# Altium schematic sheet tanh function cell.SchDoc
size Letter; SheetNumber: 14; SheetTotal: 14
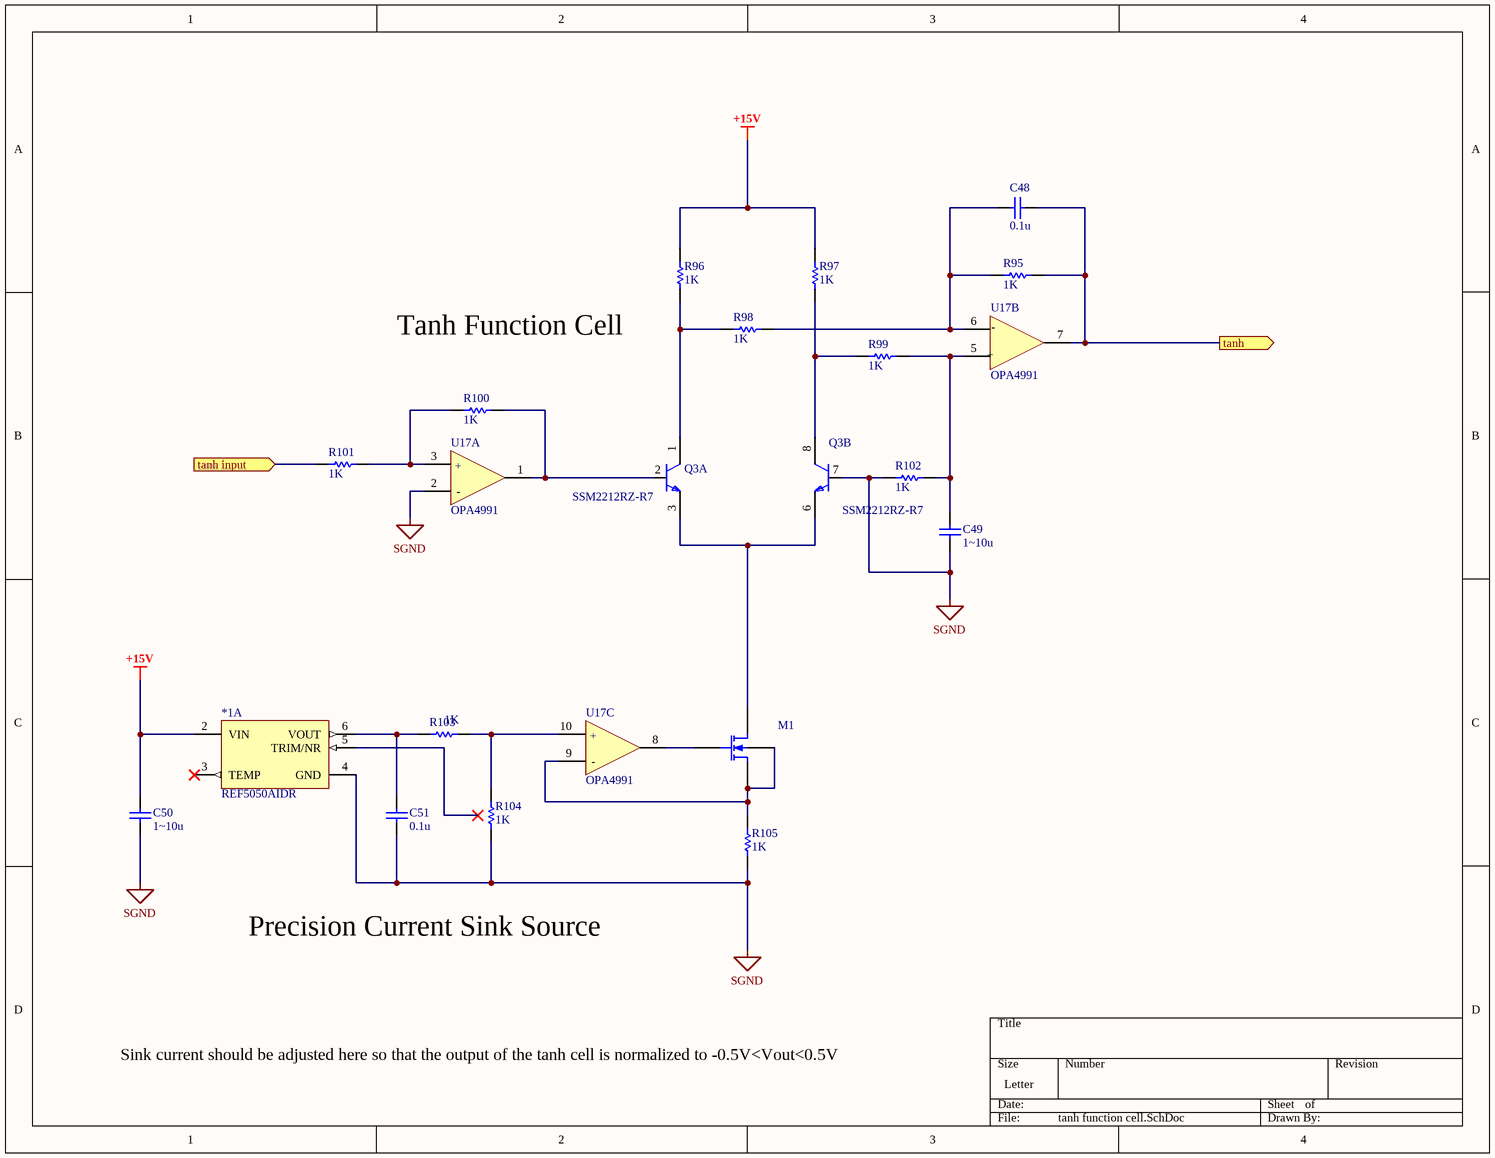
[diagram p0: tanh function cell.SchDoc]

## Parts
*1  REF5050AIDR  [D0008A_M]  (part A of 2)
C48  value 0.1u  (hidden comment: Capacitor)
C49  value 1~10u  (hidden comment: Capacitor)
C50  value 1~10u  (hidden comment: Capacitor)
C51  value 0.1u  (hidden comment: Capacitor)
M1  N-channel MOSFET BSIM4v7 v4.7.0 Model  (value not drawn)
Q3  SSM2212RZ-R7  [FP-R-8-IPC_B]  (parts A,B of 3)
R95  value 1K  (hidden comment: Resistor)
R96  value 1K  (hidden comment: Resistor)
R97  value 1K  (hidden comment: Resistor)
R98  value 1K  (hidden comment: Resistor)
R99  value 1K  (hidden comment: Resistor)
R100  value 1K  (hidden comment: Resistor)
R101  value 1K  (hidden comment: Resistor)
R102  value 1K  (hidden comment: Resistor)
R103  value 1K  (hidden comment: Resistor)
R104  value 1K  (hidden comment: Resistor)
R105  value 1K  (hidden comment: Resistor)
U17  OPA4991  [FP-D0014A-IPC_B]  (parts A,B,C of 5)

## Ports
tanh (out), tanh input (in)

## Nets
+15V: *1.2(VIN) C50.2 R96.2 R97.2
SGND: *1.4(GND) C49.1 C50.1 C51.1 Q3.7(B2) R102.1 R104.2 R105.1 U17.2(IN1-)
tanh: C48.1 R95.1 U17.7(OUT2) ; port tanh
tanh input: R101.2 ; port tanh input
Net*1_6: *1.6(VOUT) C51.2 R103.2
NetC48_2: C48.2 R95.2 R98.1 U17.6(IN2-)
NetC49_2: C49.2 R99.1 R102.2 U17.5(IN2+)
NetM1_1: M1.1(D) Q3.3(E1) Q3.6(E2)
NetM1_2: M1.2(G) U17.8(OUT3)
NetM1_3: M1.3(S) M1.4(B) R105.2 U17.9(IN3-)
NetQ3_1: Q3.1(C1) R96.1 R98.2
NetQ3_2: Q3.2(B1) R100.1 U17.1(OUT1)
NetQ3_8: Q3.8(C2) R97.1 R99.2
NetR100_2: R100.2 R101.1 U17.3(IN1+)
NetR103_1: R103.1 R104.1 U17.10(IN3+)

Not connected (* = marked no-connect by the designer): *1 3(TEMP)* 5(TRIM/NR)*

## Notes on the sheet
- (near R96) Tanh Function Cell
- Precision Current Sink Source
- Sink current should be adjusted here so that the output of the tanh cell is normalized to -0.5V<Vout<0.5V
- (in symbol OPA4991IDR, part A) +; -
- (in symbol OPA4991IDR, part B) -; +
- (in symbol OPA4991IDR, part C) +; -

## Library data of the parts
*1 = REF5050AIDR: Three Terminal Voltage Reference, 1 Output, 5V, Trim/Adjustable, PDSO8; Manufacturer: Texas Instruments; Package Body Material: Plastic; Channels: 1; Package Equivalence Code: SOP8,.25; Max Supply Voltage: 18V; Min Supply Voltage: 2.7V; Temp Coef of Voltage-Max: 3ppm/°C; Trim/Adjustable Output: Yes; Voltage Tolerance-Max: 0.1%; Max Output Voltage: 5.005V; Min Output Voltage: 4.995V; Qualification Status: Not Qualified; Supplier: Mouser; Supplier Part Number: 595-REF5050AIDR; Manufacturer Part Number: REF5050AIDR; RoHS: Yes; Category: Voltage References; Stock: 15005; Pricing: 1=3.52, 10=3.17, 50=3.17, 100=2.59, 250=2.46, 500=2.21, 1000=1.86, 2500=1.77, 5000=1.7, 10000=1.77 (USD); Case/Package: SOP; Pins: 8; Package Shape: Rectangular; Terminal Finish: Nickel; Min Operating Temperature: -40°C; Max Operating Temperature: 125°C; JESD-609 Code: e4; Throw Configuration: THREE TERMINAL VOLTAGE REFERENCE; JESD-30 Code: R-PDSO-G8; Moisture Sensitivity Level: 2; Number of Outputs: 1; Nominal Output Voltage: 5V; Package Style: SMALL OUTLINEMeter; Peak Reflow Temperature (Cel): 260°C; Surface Mount: Yes; Terminal Form: Gull Wing; Terminal Position: DUAL; Length: 4.9mm; Width: 3.9mm; Height - Seated (Max): 1.75mm; Terminal Pitch: 1.27mm; Temperature Grade: AUTOMOTIVE; Reach SVHC Compliant: Yes; RoHS Compliant: Yes; ComponentLink1URL: https://www.ti.com:443/lit/ds/symlink/ref5010.pdf?src-supplier=IHS+Markit; ComponentLink1Description: https://www.ti.com:443/lit/ds/symlink/ref5010.pdf?src-supplier=IHS+Markit; ComponentLink2URL: https://datasheet.ciiva.com/3236/ref5050-3236312.pdf?src-supplier=Avnet; ComponentLink2Description: https://datasheet.ciiva.com/3236/ref5050-3236312.pdf?src-supplier=Avnet; ComponentLink3URL: https://datasheet.ciiva.com/2012/ref5020-2012761.pdf?src-supplier=Digikey; ComponentLink3Description: https://datasheet.ciiva.com/2012/ref5020-2012761.pdf?src-supplier=Digikey
C48-C51 = Capacitor: SimulationGenericComponent: True
M1 = MOSFET N-ch Lev14_3: A0: 1; A1: 0; AIGBACC: 0.0136; AIGBINV: 0.0111; AT: 33000; BG0SUB: 1.16; BGIDL: 2.3e09; BIGBACC: 0.00171; BIGBINV: 0.000949; BVD: 10; CAPMOD: 2; CDSC: 0.00024; CF: 1.07725e-10; CGDO: 1.03594e-09; CGIDL: 0.5; CIGBACC: 0.075; CIGBINV: 0.006; CJD: 0.0005; CJSWD: 5e-10; CKAPPAD: 0.6; CLC: 1e-07; DELTA: 0.01; DROUT: 0.56; DVT0: 2.2; DVT1: 0.53; DVT1W: 5.3e06; DVT2: -0.032; EASUB: 4.05; EGIDL: 0.8; EIGBINV: 1.1; EM: 4.1e07; EOT: 1.5e-09; EPSRGATE: 11.7; EPSROX: 3.9; ETA0: 0.08; ETAB: -0.07; EU: 1.67; GBMIN: 1e-12; IJTHDFWD: 0.1; JSD: 0.0001; K3: 80; KETA: -0.047; KT1: -0.11; KT2: 0.022; LC: 5e-09; LETAB: -0; LP: 1e-08; LPE0: 1.74e-07; MJSWD: 0.33; MOIN: 15; NDEP: 1.7e17; NI0SUB: 1.45e10; NIGBINV: 3; NJTS: 20; NOIA: 6.25e41; NOIB: 3.125e26; NOIC: 8.75e09; NSD: 1e20; NSUB: 6e16; PCLM: 1.3; PDIBLC1: 0.39; PDIBLC2: 0.0086; PSCBE1: 4.24e08; PSCBE2: 1e-05; RBDBX0: 100; RBPD0: 50; RDSW: 200; RNOIA: 0.577; RNOIB: 0.5164; RNOIC: 0.395; SAREF: 1e-06; TBGASUB: 0.000702; TBGBSUB: 1108; TEMPEOT: 300.15; TNOIA: 1.5; TNOIB: 3.5; TOXE: 3e-09; U0: 0.067; UA: 1e-09; UB: 1e-19; UB1: -1e-18; UC: -4.65e-11; UC1: -5.6e-11; UCSTE: -0.004775; UTE: -1.5; VBD_MAX: 1e99; VBM: -3; VFB: -1; VOFF: -0.08; VSAT: 80000; VTH0: 0.7; VTL: 200000; W0: 2.5e-06; XJ: 1.5e-07; XRCRG1: 12; XT: 1.55e-07; XTSD: 0.02; SimulationGenericComponent: True; A2: 1; ACDE: 1; ADOS: 1; AF: 1; AGIDL: 0; AGISL: 0; AGS: 0; AIGC: 0.0136; AIGD: 0.0136; AIGS: 0.0136; AIGSD: 0.0136; ALPHA0: 0; ALPHA1: 0; B0: 0; B1: 0; BDOS: 1; BETA0: 0; BGISL: 2.3e09; BIGC: 0.00171; BIGD: 0.00171; BIGS: 0.00171; BIGSD: 0.00171; BINUNIT: 1; BVS: 10; CDSCB: 0; CDSCD: 0; CGBO: 0; CGDL: 0; CGISL: 0.5; CGSL: 0; CGSO: 1.03594e-09; CIGC: 0.075; CIGD: 0.075; CIGS: 0.075; CIGSD: 0.075; CIT: 0; CJS: 0.0005; CJSWGD: 5e-10; CJSWGS: 5e-10; CJSWS: 5e-10; CKAPPAS: 0.6; CLE: 0.6; CVCHARGEMOD: 0; DIOMOD: 1; DLC: 0; DLCIG: 0; DLCIGD: 0; DMCG: 0; DMCGT: 0; DMCI: 0; DMDG: 0; DSUB: 0.56; DTOX: 0; DVT0W: 0; DVT2W: -0.032; DVTP0: 0; DVTP1: 0; DVTP2: 0; DVTP3: 0; DVTP4: 0; DVTP5: 0; DWB: 0; DWC: 0; DWG: 0; DWJ: 0; EF: 1; EGISL: 0.8; EPSRSUB: 11.7; FGIDL: 1; FGISL: 1; FNOIMOD: 1; FPROUT: 0; GAMMA1: 0; GAMMA2: 0; GIDLMOD: 0; IGBMOD: 0; IGCMOD: 0; IJTHDREV: 0.1; IJTHSFWD: 0.1; IJTHSREV: 0.1; JSS: 0.0001; JSWD: 0; JSWGD: 0; JSWGS: 0; JSWS: 0; JTSD: 0; JTSS: 0; JTSSWD: 0; JTSSWGD: 0; JTSSWGS: 0; JTSSWS: 0; JTWEFF: 0; K1: 0; K2: 0; K2WE: 0; K3B: 0; KF: 0; KGIDL: 0; KGISL: 0; KT1L: 0; KU0: 0; KU0WE: 0; KVSAT: 0; KVTH0: 0; KVTH0WE: 0; LA0: 0; LA1: 0; LA2: 0; LACDE: 0; LAGIDL: 0; LAGISL: 0; LAGS: 0; LAIGBACC: 0; LAIGBINV: 0; LAIGC: 0; LAIGD: 0; LAIGS: 0; LAIGSD: 0; LALPHA0: 0; LALPHA1: 0; LAMBDA: 0; LAT: 0; LB0: 0; LB1: 0; LBETA0: 0; LBGIDL: 0; LBGISL: 0; LBIGBACC: 0; LBIGBINV: 0; LBIGC: 0; LBIGD: 0; LBIGS: 0; LBIGSD: 0; LCDSC: 0; LCDSCB: 0; LCDSCD: 0; LCF: 0; LCGDL: 0; LCGIDL: 0; LCGISL: 0; LCGSL: 0; LCIGBACC: 0; LCIGBINV: 0; LCIGC: 0; LCIGD: 0; LCIGS: 0; LCIGSD: 0; LCIT: 0; LCKAPPAD: 0; LCKAPPAS: 0; LCLC: 0; LCLE: 0; LDELTA: 0; LDROUT: 0; LDSUB: 0; LDVT0: 0; LDVT0W: 0; LDVT1: 0; LDVT1W: 0; LDVT2: 0; LDVT2W: 0; LDVTP0: 0; LDVTP1: 0; LDVTP2: 0; LDVTP3: 0; LDVTP4: 0; LDVTP5: 0; LDWB: 0; LDWG: 0; LEFFEOT: 1; LEGIDL: 0; LEGISL: 0; LEIGBINV: 0; LETA0: 0; LEU: 0; LFGIDL: 0; LFGISL: 0; LFPROUT: 0; LGAMMA1: 0; LGAMMA2: 0; LINT: 0; LINTNOI: 0; LK1: 0; LK2: 0; LK2WE: 0; LK3: 0; LK3B: 0; LKETA: 0; LKGIDL: 0; LKGISL: 0; LKT1: 0; LKT1L: 0; LKT2: 0; LKU0: 0; LKU0WE: 0; LKVTH0: 0; LKVTH0WE: 0; LL: 0; LLAMBDA: 0; LLC: 0; LLN: 1; LLODKU0: 0; LLODVTH: 0; LLP: 0; LLPE0: 0; LLPEB: 0; LMAX: 1; LMIN: 0; LMINV: 0; LMINVCV: 0; LMOIN: 0; LNDEP: 0; LNFACTOR: 0; LNGATE: 0; LNIGBACC: 0; LNIGBINV: 0; LNIGC: 0; LNOFF: 0; LNSD: 0; LNSUB: 0; LNTOX: 0; LODETA0: 1; LODK2: 1; LPCLM: 0; LPDIBLC1: 0; LPDIBLC2: 0; LPDIBLCB: 0; LPDITS: 0; LPDITSD: 0; LPEB: 0; LPHIN: 0; LPIGCD: 0; LPOXEDGE: 0; LPRT: 0; LPRWB: 0; LPRWG: 0; LPSCBE1: 0; LPSCBE2: 0; LPVAG: 0; LRDSW: 0; LRDW: 0; LRGIDL: 0; LRGISL: 0; LRSW: 0; LTETA0: 0; LTNFACTOR: 0; LTVFBSDOFF: 0; LTVOFF: 0; LTVOFFCV: 0; LU0: 0; LUA: 0; LUA1: 0; LUB: 0; LUB1: 0; LUC: 0; LUC1: 0; LUCS: 0; LUCSTE: 0; LUD: 0; LUD1: 0; LUP: 0; LUTE: 0; LVBM: 0; LVBX: 0; LVFB: 0; LVFBCV: 0; LVFBSDOFF: 0; LVOFF: 0; LVOFFCV: 0; LVSAT: 0; LVTH0: 0; LVTL: 0; LW: 0; LW0: 0; LWC: 0; LWL: 0; LWLC: 0; LWN: 1; LWR: 0; LXJ: 0; LXN: 0; LXRCRG1: 0; LXRCRG2: 0; LXT: 0; MINV: 0; MINVCV: 0; MJD: 0.5; MJS: 0.5; MJSWGD: 0.33; MJSWGS: 0.33; MJSWS: 0.33; MOBMOD: 0; MTRLCOMPATMOD: 0; MTRLMOD: 0; NFACTOR: 1; NGATE: 0; NIGBACC: 1; NIGC: 1; NJD: 1; NJS: 1; NJTSD: 20; NJTSSW: 20; NJTSSWD: 20; NJTSSWG: 20; NJTSSWGD: 20; NOFF: 1; NTNOI: 1; NTOX: 1; PA0: 0; PA1: 0; PA2: 0; PACDE: 0; PAGIDL: 0; PAGISL: 0; PAGS: 0; PAIGBACC: 0; PAIGBINV: 0; PAIGC: 0; PAIGD: 0; PAIGS: 0; PAIGSD: 0; PALPHA0: 0; PALPHA1: 0; PARAMCHK: 1; PAT: 0; PB0: 0; PB1: 0; PBD: 1; PBETA0: 0; PBGIDL: 0; PBGISL: 0; PBIGBACC: 0; PBIGBINV: 0; PBIGC: 0; PBIGD: 0; PBIGS: 0; PBIGSD: 0; PBS: 1; PBSWD: 1; PBSWGD: 1; PBSWGS: 1; PBSWS: 1; PCDSC: 0; PCDSCB: 0; PCDSCD: 0; PCF: 0; PCGDL: 0; PCGIDL: 0; PCGISL: 0; PCGSL: 0; PCIGBACC: 0; PCIGBINV: 0; PCIGC: 0; PCIGD: 0; PCIGS: 0; PCIGSD: 0; PCIT: 0; PCKAPPAD: 0; PCKAPPAS: 0; PCLC: 0; PCLE: 0; PDELTA: 0; PDIBLCB: 0; PDITS: 0; PDITSD: 0; PDITSL: 0; PDROUT: 0; PDSUB: 0; PDVT0: 0; PDVT0W: 0; PDVT1: 0; PDVT1W: 0; PDVT2: 0; PDVT2W: 0; PDVTP0: 0; PDVTP1: 0; PDVTP2: 0; PDVTP3: 0; PDVTP4: 0; PDVTP5: 0; PDWB: 0; PDWG: 0; PEGIDL: 0; PEGISL: 0; PEIGBINV: 0; PERMOD: 1; PETA0: 0; PETAB: 0; PEU: 0; PFGIDL: 0; PFGISL: 0; PFPROUT: 0; PGAMMA1: 0; PGAMMA2: 0; PHIG: 4.05; PHIN: 0; PIGCD: 1; PK1: 0; PK2: 0; PK2WE: 0; PK3: 0; PK3B: 0; PKETA: 0; PKGIDL: 0; PKGISL: 0; PKT1: 0; PKT1L: 0; PKT2: 0; PKU0: 0; PKU0WE: 0; PKVTH0: 0; PKVTH0WE: 0; PLAMBDA: 0; PLP: 0; PLPE0: 0; PLPEB: 0; PMINV: 0; PMINVCV: 0; PMOIN: 0; PNDEP: 0; PNFACTOR: 0; PNGATE: 0; PNIGBACC: 0; PNIGBINV: 0; PNIGC: 0; PNOFF: 0; PNSD: 0; PNSUB: 0; PNTOX: 0; POXEDGE: 1; PPCLM: 0; PPDIBLC1: 0; PPDIBLC2: 0; PPDIBLCB: 0; PPDITS: 0; PPDITSD: 0; PPHIN: 0; PPIGCD: 0; PPOXEDGE: 0; PPRT: 0; PPRWB: 0; PPRWG: 0; PPSCBE1: 0; PPSCBE2: 0; PPVAG: 0; PRDSW: 0; PRDW: 0; PRGIDL: 0; PRGISL: 0; PRSW: 0; PRT: 0; PRWB: 0; PRWG: 1; PTETA0: 0; PTNFACTOR: 0; PTVFBSDOFF: 0; PTVOFF: 0; PTVOFFCV: 0; PU0: 0; PUA: 0; PUA1: 0; PUB: 0; PUB1: 0; PUC: 0; PUC1: 0; PUCS: 0; PUCSTE: 0; PUD: 0; PUD1: 0; PUP: 0; PUTE: 0; PVAG: 0; PVBM: 0; PVBX: 0; PVFB: 0; PVFBCV: 0; PVFBSDOFF: 0; PVOFF: 0; PVOFFCV: 0; PVSAT: 0; PVTH0: 0; PVTL: 0; PW0: 0; PWR: 0; PXJ: 0; PXN: 0; PXRCRG1: 0; PXRCRG2: 0; PXT: 0; RBDBY0: 100; RBPBX0: 100; RBPBXL: 0; RBPBXNF: 0; RBPBXW: 0; RBPBY0: 100; RBPBYL: 0; RBPBYNF: 0; RBPBYW: 0; RBPDL: 0; RBPDNF: 0; RBPDW: 0; RBPS0: 50; RBPSL: 0; RBPSNF: 0; RBPSW: 0; RBSBX0: 100; RBSBY0: 100; RBSDBXL: 0; RBSDBXNF: 0; RBSDBXW: 0; RBSDBYL: 0; RBSDBYNF: 0; RBSDBYW: 0; RDSMOD: 0; RDSWMIN: 0; RDW: 100; RDWMIN: 0; RGIDL: 1; RGISL: 1; RSH: 0; RSHG: 0.1; RSW: 100; RSWMIN: 0; SBREF: 1e-06; SCREF: 1e-06; STETA0: 0; STK2: 0; TCJ: 0; TCJSW: 0; TCJSWG: 0; TEMPMOD: 0; TETA0: 0; TKU0: 0; TNFACTOR: 0; TNJTS: 0; TNJTSD: 0; TNJTSSW: 0; TNJTSSWD: 0; TNJTSSWG: 0; TNJTSSWGD: 0; TNOIC: 0; TNOIMOD: 0; TNOM: 300.15; TOXM: 3e-09; TOXP: 3e-09; TOXREF: 3e-09; TPB: 0; TPBSW: 0; TPBSWG: 0; TVFBSDOFF: 0; TVOFF: 0; TVOFFCV: 0; UA1: 1e-09; UCS: 1.67; UD: 0; UD1: 0; UP: 0; VBDR_MAX: 1e99; VBS_MAX: 1e99; VBSR_MAX: 1e99; VBX: 0; VDDEOT: 1.5; VDS_MAX: 1e99; VERSION: 4.8.1; VFBCV: -1; VFBSDOFF: 0; VGB_MAX: 1e99; VGBR_MAX: 1e99; VGD_MAX: 1e99; VGDR_MAX: 1e99; VGS_MAX: 1e99; VGSR_MAX: 1e99; VOFFCV: 0; VOFFCVL: 0; VOFFL: 0; VTSD: 10; VTSS: 10; VTSSWD: 10; VTSSWGD: 10; VTSSWGS: 10; VTSSWS: 10; WA0: 0; WA1: 0; WA2: 0; WACDE: 0; WAGIDL: 0; WAGISL: 0; WAGS: 0; WAIGBACC: 0; WAIGBINV: 0; WAIGC: 0; WAIGD: 0; WAIGS: 0; WAIGSD: 0; WALPHA0: 0; WALPHA1: 0; WAT: 0; WB0: 0; WB1: 0; WBETA0: 0; WBGIDL: 0; WBGISL: 0; WBIGBACC: 0; WBIGBINV: 0; WBIGC: 0; WBIGD: 0; WBIGS: 0; WBIGSD: 0; WCDSC: 0; WCDSCB: 0; WCDSCD: 0; WCF: 0; WCGDL: 0; WCGIDL: 0; WCGISL: 0; WCGSL: 0; WCIGBACC: 0; WCIGBINV: 0; WCIGC: 0; WCIGD: 0; WCIGS: 0; WCIGSD: 0; WCIT: 0; WCKAPPAD: 0; WCKAPPAS: 0; WCLC: 0; WCLE: 0; WDELTA: 0; WDROUT: 0; WDSUB: 0; WDVT0: 0; WDVT0W: 0; WDVT1: 0; WDVT1W: 0; WDVT2: 0; WDVT2W: 0; WDVTP0: 0; WDVTP1: 0; WDVTP2: 0; WDVTP3: 0; WDVTP4: 0; WDVTP5: 0; WDWB: 0; WDWG: 0; WEB: 0; WEC: 0; WEFFEOT: 10; WEGIDL: 0; WEGISL: 0; WEIGBINV: 0; WETA0: 0; WETAB: 0; WEU: 0; WFGIDL: 0; WFGISL: 0; WFPROUT: 0; WGAMMA1: 0; WGAMMA2: 0; WINT: 0; WK1: 0; WK2: 0; WK2WE: 0; WK3: 0; WK3B: 0; WKETA: 0; WKGIDL: 0; WKGISL: 0; WKT1: 0; WKT1L: 0; WKT2: 0; WKU0: 0; WKU0WE: 0; WKVTH0: 0; WKVTH0WE: 0; WL: 0; WLAMBDA: 0; WLC: 0; WLN: 1; WLOD: 0; WLODKU0: 0; WLODVTH: 0; WLP: 0; WLPE0: 0; WLPEB: 0; WMAX: 1; WMIN: 0; WMINV: 0; WMINVCV: 0; WMOIN: 0; WNDEP: 0; WNFACTOR: 0; WNGATE: 0; WNIGBACC: 0; WNIGBINV: 0; WNIGC: 0; WNOFF: 0; WNSD: 0; WNSUB: 0; WNTOX: 0; WPCLM: 0; WPDIBLC1: 0; WPDIBLC2: 0; WPDIBLCB: 0; WPDITS: 0; WPDITSD: 0; WPEMOD: 0; WPHIN: 0; WPIGCD: 0; WPOXEDGE: 0; WPRT: 0; WPRWB: 0; WPRWG: 0; WPSCBE1: 0; WPSCBE2: 0; WPVAG: 0; WR: 1; WRDSW: 0; WRDW: 0; WRGIDL: 0; WRGISL: 0; WRSW: 0; WTETA0: 0; WTNFACTOR: 0; WTVFBSDOFF: 0; WTVOFF: 0; WTVOFFCV: 0; WU0: 0; WUA: 0; WUA1: 0; WUB: 0; WUB1: 0; WUC: 0; WUC1: 0; WUCS: 0; WUCSTE: 0; WUD: 0; WUD1: 0; WUP: 0; WUTE: 0; WVBM: 0; WVBX: 0; WVFB: 0; WVFBCV: 0; WVFBSDOFF: 0; WVOFF: 0; WVOFFCV: 0; WVSAT: 0; WVTH0: 0; WVTL: 0; WW: 0; WW0: 0; WWC: 0; WWL: 0; WWLC: 0; WWN: 1; WWR: 0; WXJ: 0; WXN: 0; WXRCRG1: 0; WXRCRG2: 0; WXT: 0; XGL: 0; XJBVD: 1; XJBVS: 1; XL: 0; XN: 3; XPART: 0; XRCRG2: 1; XTID: 3; XTIS: 3; XTSS: 0.02; XTSSWD: 0.02; XTSSWGD: 0.02; XTSSWGS: 0.02; XTSSWS: 0.02; XW: 0
Q3 = SSM2212: TRANS 2NPN 40V 0.02A 8SOIC; Transition Frequency: 450MHz; Max Power Dissipation: 500mW; Element Configuration: Dual; Max Collector Current: 20mA; Polarity: NPN; Collector Emitter Breakdown Voltage: 45V; Number of Elements: 2; Collector-emitter Voltage-Max: 800mV; Frequency: 200MHz; Packaging: Tape and Reel; RoHS Compliant: Yes; Lead Free: Contains Lead; Contact Plating: Tin; Collector Emitter Voltage (VCEO): 40V; Max Breakdown Voltage: 40V; Case/Package: SOIC; Series: SSM2212; Radiation Hardening: No; Package Quantity: 1000; Number of Pins: 8; Collector Base Voltage (VCBO): 40V; Mount: Surface Mount; Max Operating Temperature: 85°C; Min Operating Temperature: -40°C
R95-R105 = Resistor: TC1: 0; SimulationGenericComponent: True; TC2: 0
U17 = OPA4991IDR: 40-V, DUAL 4.5MHZ, RAIL-TO-RAIL